# EasyEDA Pro project powermanagmen.eprj

# Schematic powermanagmen
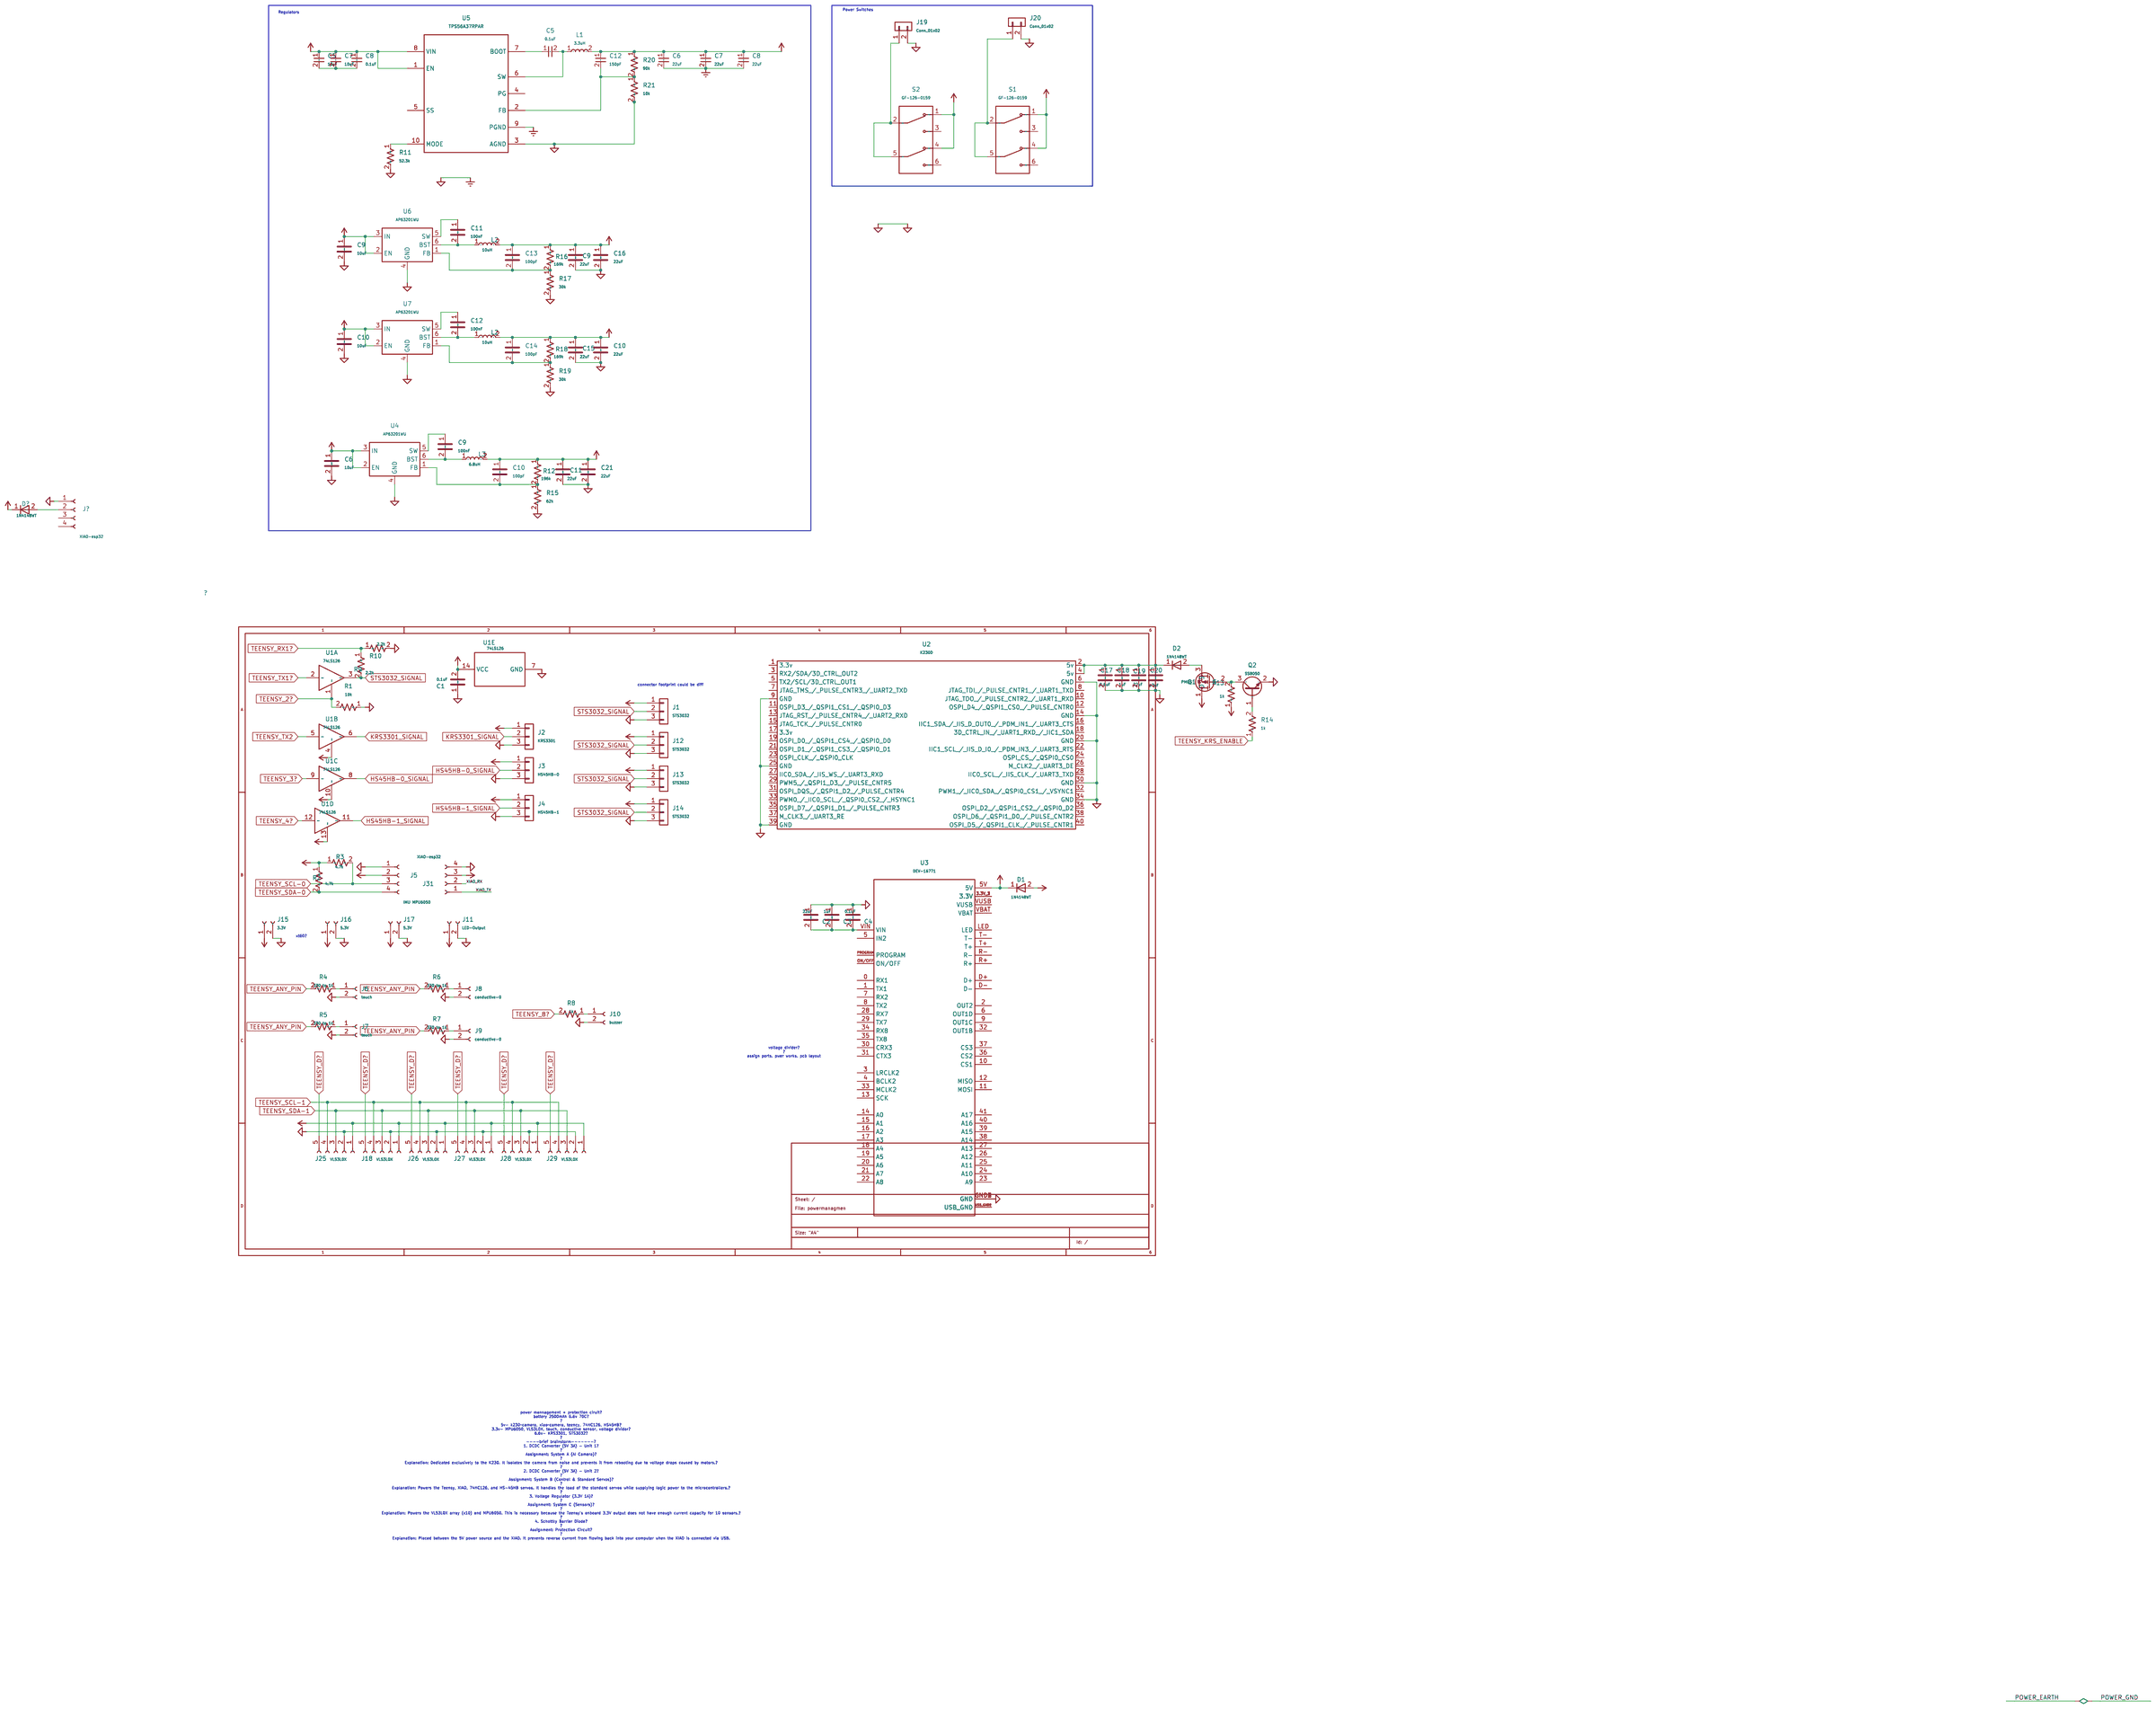
[diagram p0: schematic sheet]

## Parts
C1  0.1uF  [Capacitor_SMD:C_0603_1608Metric_Pad1.08x0.95mm_HandSolder]
C2  22uF
C3  1uF
C4  0.1uF
C5  10uF
C5#2  0.1uF
C6  22uF
C6#2  10uF
C7  22uF
C7#2  10uF
C8  22uF
C8#2  0.1uF
C9  10uF
C9#2  100nF
C9#3  22uF
C10  100pF
C10#2  10uF
C10#3  22uF
C11  100nF
C11#2  22uF
C12  150pF
C12#2  100nF
C13  100pF
C14  100pF
C15  22uF
C16  22uF
C17  0.1uF
C18  1uF
C19  22uF
C20  47uF
C21  22uF
D1  1N4148WT
D2  1N4148WT
D?#2  1N4148WT
J1  STS3032  [Connector_PinHeader_1.00mm:PinHeader_1x03_P1.00mm_Vertical]
J2  KRS3301  [Connector_PinHeader_1.00mm:PinHeader_1x03_P1.00mm_Vertical]
J3  HS45HB-0  [Connector_PinHeader_1.00mm:PinHeader_1x03_P1.00mm_Vertical]
J4  HS45HB-1  [Connector_PinHeader_1.00mm:PinHeader_1x03_P1.00mm_Vertical]
J5  IMU MPU6050  [Connector_JST:JST_XH_B4B-XH-A_1x04_P2.50mm_Vertical]
J6  touch
J7  touch
J8  conductive-0
J9  conductive-0
J10  buzzer
J11  LED-Output
J12  STS3032  [Connector_PinHeader_1.00mm:PinHeader_1x03_P1.00mm_Vertical]
J13  STS3032  [Connector_PinHeader_1.00mm:PinHeader_1x03_P1.00mm_Vertical]
J14  STS3032  [Connector_PinHeader_1.00mm:PinHeader_1x03_P1.00mm_Vertical]
J15  3.3V
J16  5.3V
J17  5.3V
J18  VL53L0X
J19  Conn_01x02
J20  Conn_01x02
J25  VL53L0X
J26  VL53L0X
J27  VL53L0X
J28  VL53L0X
J29  VL53L0X
J31  XIAO-esp32  [Connector_JST:JST_XH_B4B-XH-A_1x04_P2.50mm_Vertical]
J?#1  XIAO-esp32  [Connector_JST:JST_XH_B4B-XH-A_1x04_P2.50mm_Vertical]
L1  3.3uH
L2  10uH
L2#2  10uH
L3  6.8uH
Q1  PMOS
Q2  SS8050
R1  10k  [Resistor_SMD:R_0603_1608Metric_Pad0.98x0.95mm_HandSolder]
R2  4.7k  [Resistor_SMD:R_0603_1608Metric_Pad0.98x0.95mm_HandSolder]
R3  4.7k  [Resistor_SMD:R_0603_1608Metric_Pad0.98x0.95mm_HandSolder]
R4  330 to 1k  [Resistor_SMD:R_0603_1608Metric_Pad0.98x0.95mm_HandSolder]
R5  330 to 1k  [Resistor_SMD:R_0603_1608Metric_Pad0.98x0.95mm_HandSolder]
R6  330 to 1k  [Resistor_SMD:R_0603_1608Metric_Pad0.98x0.95mm_HandSolder]
R7  330 to 1k  [Resistor_SMD:R_0603_1608Metric_Pad0.98x0.95mm_HandSolder]
R8  1k  [Resistor_SMD:R_0603_1608Metric_Pad0.98x0.95mm_HandSolder]
R9  2.2k  [Resistor_SMD:R_0603_1608Metric_Pad0.98x0.95mm_HandSolder]
R10  2.2k  [Resistor_SMD:R_0603_1608Metric_Pad0.98x0.95mm_HandSolder]
R11  52.3k
R12  196k
R13  1k
R14  1k
R15  62k
R16  169k
R17  30k
R18  169k
R19  30k
R20  90k
R21  10k
S1  GF-126-0159
S2  GF-126-0159
U1  74LS126  [Package_SO:SOIC-14_3.9x8.7mm_P1.27mm]  (sections 1,2,3,4,5)
U2  K230D  [Connector_PinSocket_2.54mm:PinSocket_2x20_P2.54mm_Vertical_SMD]
U3  DEV-16771
U4  AP63201WU
U5  TPS56A37RPAR
U6  AP63201WU
U7  AP63201WU

## Library data of the parts
C1-C4 C6#2 C9 C9#2 C9#3 C10 C10#2 C10#3 C11 C11#2 C12#2 C13-C21 = Device_C: Unpolarized capacitor
C5 C5#2 C6 C7 C7#2 C8 C8#2 C12 = Device_C_Small: Unpolarized capacitor, small symbol
D1 D2 D?#2 = Diode_1N4148WT: 75V 0.15A Fast switching Diode, SOD-523; User doc link: https://www.diodes.com/assets/Datasheets/ds30396.pdf; Sim_Device: D; Sim_Pins: 1=K 2=A; Sim.Device: D; Sim.Pins: 1=K 2=A
J1 J3 J4 J12-J14 = Connector_Generic_Conn_01x03: Generic connector, single row, 01x03, script generated (kicad-library-utils/schlib/autogen/connector/); Attribute1: J2
J2 = Connector_Generic_Conn_01x03: Generic connector, single row, 01x03, script generated (kicad-library-utils/schlib/autogen/connector/)
J5 = Connector_Conn_01x04_Socket: Generic connector, single row, 01x04, script generated
J6-J11 J15-J17 = Connector_Conn_01x02_Socket: Generic connector, single row, 01x02, script generated
J18 J25-J29 = Connector_Conn_01x05_Socket: Generic connector, single row, 01x05, script generated
J19 J20 = Connector_Generic_Conn_01x02: Generic connector, single row, 01x02, script generated (kicad-library-utils/schlib/autogen/connector/)
J31 J?#1 = Connector_Conn_01x04_Socket: Generic connector, single row, 01x04, script generated; Attribute1: J5
L1 L2 L2#2 L3 = Device_L: Inductor
Q1 = Simulation_SPICE_PMOS: P-MOSFET transistor, drain/source/gate; User doc link: https://ngspice.sourceforge.io/docs/ngspice-html-manual/manual.xhtml#cha_MOSFETs; Sim_Type: VDMOS; Sim_Pins: 1=D 2=G 3=S; Sim.Type: VDMOS; Sim.Pins: 1=D 2=G 3=S
Q2 = Transistor_BJT_SS8050: General Purpose NPN Transistor, 1.5A Ic, 25V Vce, SOT-23; User doc link: http://www.secosgmbh.com/datasheet/products/SSMPTransistor/SOT-23/SS8050.pdf
R1 R11-R21 = Device_R_US: Resistor, US symbol
R2-R10 = Device_R_US: Resistor, US symbol; Attribute1: R1
S1 S2 = GF-126-0159_GF-126-0159: MF: CW Industries; Purchase-URL: https://pricing.snapeda.com/search/part/GF-126-0159/?ref=eda; Package1: None; Price: None; Availability: In Stock; Description_1: Slide Switch DPDT Through Hole
U1 = 74xx_74LS126: Quad buffer 3-State outputs; Datasheet: http://www.ti.com/lit/gpn/sn74LS126; User doc link: http://www.ti.com/lit/gpn/sn74LS126
U2 = K230D_K230D-Zero: Datasheet: https://docs.banana-pi.org/en/BPI-CanMV-K230D/BananaPi_BPI-CanMV-K230D-Zero; User doc link: https://docs.banana-pi.org/en/BPI-CanMV-K230D/BananaPi_BPI-CanMV-K230D-Zero
U3 = DEV-16771_DEV-16771: MF: SparkFun Electronics; MAXIMUM_PACKAGE_HEIGHT: 4.07mm; Package1: None; Price: None; Check_prices: https://www.snapeda.com/parts/DEV-16771/SparkFun/view-part/?ref=eda; STANDARD: Manufacturer recommendations; PARTREV: 4.1; SnapEDA_Link: https://www.snapeda.com/parts/DEV-16771/SparkFun/view-part/?ref=snap; Description_1: RT1062 Teensy 4.1 series ARM- Cortex--M7 MPU Embedded Evaluation Board; Availability: In Stock; MANUFACTURER: SparkFun Electronics
U4 U6 U7 = Regulator_Switching_AP63201WU: 2A, 500kHz Buck DC/DC Converter, adjustable output voltage, TSOT-23-6; User doc link: https://www.diodes.com/assets/Datasheets/AP63200-AP63201-AP63203-AP63205.pdf
U5 = 2026-01-05_00-17-44_TPS56A37RPAR: User doc link: https://www.ti.com/lit/gpn/tps56a37

## Nets
HS45HB-0_SIGNAL: J3.2(Pin) U1.8
HS45HB-1_SIGNAL: J4.2(Pin) U1.11
KRS3301_SIGNAL: J2.2(Pin) U1.6
POWER_+1V0: C6#2.1 C9.1 C9#3.1 C10.1 C10#2.1 C10#3.1 C11#2.1 C13.1 C14.1 C15.1 C16.1 C21.1 D1.1(K) D1.2(A) D?#2.1(K) J11.1(Pin) J15.1(Pin) J16.1(Pin) J17.1(Pin) J31.3(Pin) L2.2 L2#2.2 L3.2 Q1.1(D) R12.1 R13.1 R16.1 R18.1 S1.1 S1.4 S2.1 S2.4 U3.5V U4.2(EN) U4.3(IN) U6.2(EN) U6.3(IN) U7.2(EN) U7.3(IN)
POWER_+3.3V: J5.2(Pin) J18.1(Pin) J25.1(Pin) J26.1(Pin) J27.1(Pin) J28.1(Pin) J29.1(Pin) R2.1 R3.1
POWER_+5V: C1.2 J3.1(Pin) J4.1(Pin) U1.4 U1.10 U1.13 U1.14(VCC)
POWER_+6V: C5.1 C6.1 C7.1 C7#2.1 C8.1 C8#2.1 C12.1 J1.1(Pin) J2.1(Pin) J12.1(Pin) J13.1(Pin) J14.1(Pin) L1.2 R20.1 U5.1(EN) U5.8(VIN)
POWER_EARTH: C1.1 C2.1 C3.1 C4.1 C6.2 C6#2.2 C7.2 C8.2 C9.2 C9#3.2 C10#2.2 C10#3.2 C11#2.2 C15.2 C16.2 C17.2 C18.2 C19.2 C20.2 C21.2 J1.3(Pin) J2.3(Pin) J3.3(Pin) J4.3(Pin) J5.1(Pin) J6.2(Pin) J7.2(Pin) J8.2(Pin) J9.2(Pin) J10.2(Pin) J11.2(Pin) J12.3(Pin) J13.3(Pin) J14.3(Pin) J15.2(Pin) J16.2(Pin) J17.2(Pin) J18.2(Pin) J19.2(Pin) J20.2(Pin) J25.2(Pin) J26.2(Pin) J27.2(Pin) J28.2(Pin) J29.2(Pin) J31.4(Pin) J?#1.1(Pin) Q2.2(E) R1.1 R10.2 R11.2 R15.2 R17.2 R19.2 R21.2 U1.7(GND) U2.6(GND) U2.9(GND) U2.14(GND) U2.20(GND) U2.25(GND) U2.30(GND) U2.34(GND) U2.39(GND) U3.GND1(GND) U3.GND2(GND) U3.GND3(GND) U3.GND4(GND) U3.GND5(GND) U4.4(GND) U5.3(AGND) U5.9(PGND) U6.4(GND) U7.4(GND)
STS3032_SIGNAL: J1.2(Pin) J12.2(Pin) J13.2(Pin) J14.2(Pin) R9.2 U1.3
TEENSY_2?: R1.2 U1.1
TEENSY_3?: U1.9
TEENSY_4?: U1.12
TEENSY_8?: R8.2
TEENSY_ANY_PIN: R4.2 R5.2 R6.2 R7.2
TEENSY_D?: J18.5(Pin) J25.5(Pin) J26.5(Pin) J27.5(Pin) J28.5(Pin) J29.5(Pin)
TEENSY_KRS_ENABLE: R14.1
TEENSY_RX1?: R9.1 R10.1
TEENSY_SCL-0: J5.3(Pin) R3.2
TEENSY_SCL-1: J18.4(Pin) J25.4(Pin) J26.4(Pin) J27.4(Pin) J28.4(Pin) J29.4(Pin)
TEENSY_SDA-0: J5.4(Pin) R2.2
TEENSY_SDA-1: J18.3(Pin) J25.3(Pin) J26.3(Pin) J27.3(Pin) J28.3(Pin) J29.3(Pin)
TEENSY_TX1?: U1.2
TEENSY_TX2: U1.5
XIAO_RX: J31.2(Pin)
XIAO_TX: J31.1(Pin)
Net-(C2-2): C2.2 C3.2 C4.2 U3.VIN
Net-(C5#2-1): C5#2.1 U5.7(BOOT)
Net-(C5#2-2): C5#2.2 L1.1 U5.6(SW)
Net-(C5-2): C5.2 C7#2.2 C8#2.2
Net-(C9#2-1): C9#2.1 U4.5(SW)
Net-(C9#2-2): C9#2.2 L3.1 U4.6(BST)
Net-(C10-2): C10.2 R12.2 R15.1 U4.1(FB)
Net-(C11-1): C11.1 U6.5(SW)
Net-(C11-2): C11.2 L2.1 U6.6(BST)
Net-(C12#2-1): C12#2.1 U7.5(SW)
Net-(C12#2-2): C12#2.2 L2#2.1 U7.6(BST)
Net-(C12-2): C12.2 R20.2 R21.1 U5.2(FB)
Net-(C13-2): C13.2 R16.2 R17.1 U6.1(FB)
Net-(C14-2): C14.2 R18.2 R19.1 U7.1(FB)
Net-(C17-1): C17.1 C18.1 C19.1 C20.1 D2.1(K) U2.2(5v) U2.4(5v)
Net-(D2-2): D2.2(A) Q1.3(S)
Net-(D?#2-2): D?#2.2(A) J?#1.2(Pin)
Net-(J6-1): J6.1(Pin) R4.1
Net-(J7-1): J7.1(Pin) R5.1
Net-(J8-1): J8.1(Pin) R6.1
Net-(J9-1): J9.1(Pin) R7.1
Net-(J10-1): J10.1(Pin) R8.1
Net-(J19-1): J19.1(Pin) S2.2 S2.5
Net-(J20-1): J20.1(Pin) S1.2 S1.5
Net-(Q1-2): Q1.2(G) Q2.3(C) R13.2
Net-(Q2-1): Q2.1(B) R14.2
Net-(R11-1): R11.1 U5.10(MODE)
Net-(U3-3.3V_1): U3.3.3V_1(3.3V) U3.3.3V_2(3.3V) U3.3.3V_3(3.3V)
Net-(U3-USB_GND1): U3.USB_GND1(USB_GND) U3.USB_GND2(USB_GND)

Not connected (* = marked no-connect by the designer): J?#1 3(Pin) 4(Pin); S1 3 6; S2 3 6; U2 1(3.3v) 3(RX2/SDA/3D_CTRL_OUT2) 5(TX2/SCL/3D_CTRL_OUT1) 7(JTAG_TMS_/_PULSE_CNTR3_/_UART2_TXD) 8(JTAG_TDI_/_PULSE_CNTR1_/_UART1_TXD) 10(JTAG_TDO_/_PULSE_CNTR2_/_UART1_RXD) 11(OSPI_D3_/_QSPI1_CS1_/_QSPI0_D3) 12(OSPI_D4_/_QSPI1_CS0_/_PULSE_CNTR0) 13(JTAG_RST_/_PULSE_CNTR4_/_UART2_RXD) 15(JTAG_TCK_/_PULSE_CNTR0) 16(IIC1_SDA_/_IIS_D_OUT0_/_PDM_IN1_/_UART3_CTS) 17(3.3v) 18(3D_CTRL_IN_/_UART1_RXD_/_IIC1_SDA) 19(OSPI_D0_/_QSPI1_CS4_/_QSPI0_D0) 21(OSPI_D1_/_QSPI1_CS3_/_QSPI0_D1) 22(IIC1_SCL_/_IIS_D_I0_/_PDM_IN3_/_UART3_RTS) 23(OSPI_CLK_/_QSPI0_CLK) 24(OSPI_CS_/_QSPI0_CS0) 26(M_CLK2_/_UART3_DE) 27(IIC0_SDA_/_IIS_WS_/_UART3_RXD) 28(IIC0_SCL_/_IIS_CLK_/_UART3_TXD) 29(PWM5_/_QSPI1_D3_/_PULSE_CNTR5) 31(OSPI_DQS_/_QSPI1_D2_/_PULSE_CNTR4) 32(PWM1_/_IIC0_SDA_/_QSPI0_CS1_/_VSYNC1) 33(PWM0_/_IIC0_SCL_/_QSPI0_CS2_/_HSYNC1) 35(OSPI_D7_/_QSPI1_D1_/_PULSE_CNTR3) 36(OSPI_D2_/_QSPI1_CS2_/_QSPI0_D2) 37(M_CLK3_/_UART3_RE) 38(OSPI_D6_/_QSPI1_D0_/_PULSE_CNTR2) 40(OSPI_D5_/_QSPI1_CLK_/_PULSE_CNTR1); U3 0(RX1) 1(TX1) 2(OUT2) 3(LRCLK2) 4(BCLK2) 5(IN2) 6(OUT1D) 7(RX2) 8(TX2) 9(OUT1C) 10(CS1) 11(MOSI) 12(MISO) 13(SCK) 14(A0) 15(A1) 16(A2) 17(A3) 18(A4) 19(A5) 20(A6) 21(A7) 22(A8) 23(A9) 24(A10) 25(A11) 26(A12) 27(A13) 28(RX7) 29(TX7) 30(CRX3) 31(CTX3) 32(OUT1B) 33(MCLK2) 34(RX8) 35(TX8) 36(CS2) 37(CS3) 38(A14) 39(A15) 40(A16) 41(A17) D+ D- LED ON/OFF PROGRAM R+ R- T+ T- VBAT VUSB; U5 4(PG) 5(SS)

## Notes on the sheet
- Regulators
- Power Switches
- connector footprint could be diff
- xt60?
- voltage divider
  assign ports. pwer works. pcb layout
- power mannagement + protection ciruit
  battery 2500mAh 6.6v 70C
  5v- k230~camera, xiao~camera, teency, 74HC126, HS45HB
  3.3v- MPU6050, VL53L0X, touch, conductive sensor, voltage dividor
  6.6v- KRS3301, STS3032
  ----brief brainstorm-------
  1. DCDC Converter (5V 3A) - Unit 1
  Assignment: System A (AI Camera)
  Explanation: Dedicated exclusively to the K230. It isolates the camera from noise and prevents it from rebooting due to voltage drops caused by motors.
  2. DCDC Converter (5V 3A) - Unit 2
  Assignment: System B (Control & Standard Servos)
  Explanation: Powers the Teensy, XIAO, 74HC126, and HS-45HB servos. It handles the load of the standard servos while supplying logic power to the microcontrollers.
  3. Voltage Regulator (3.3V 1A)
  Assignment: System C (Sensors)
  Explanation: Powers the VL53L0X array (x10) and MPU6050. This is necessary because the Teensy's onboard 3.3V output does not have enough current capacity for 10 sensors.
  4. Schottky Barrier Diode
  Assignment: Protection Circuit
  Explanation: Placed between the 5V power source and the XIAO. It prevents reverse current from flowing back into your computer when the XIAO is connected via USB.

# Board powermanagmen
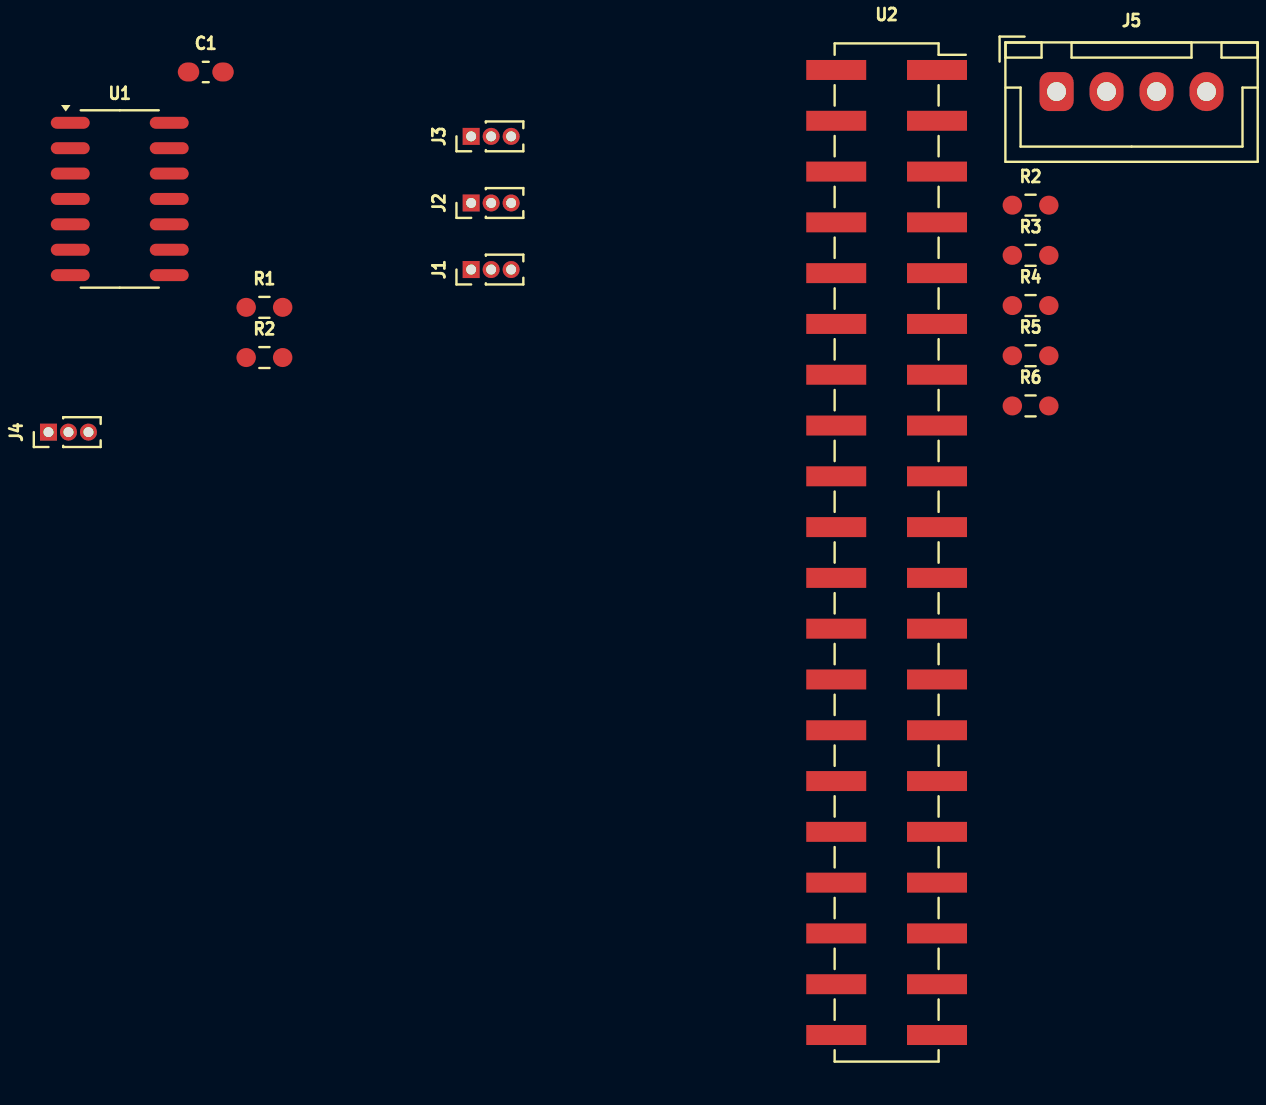
[diagram p1: board, top side]
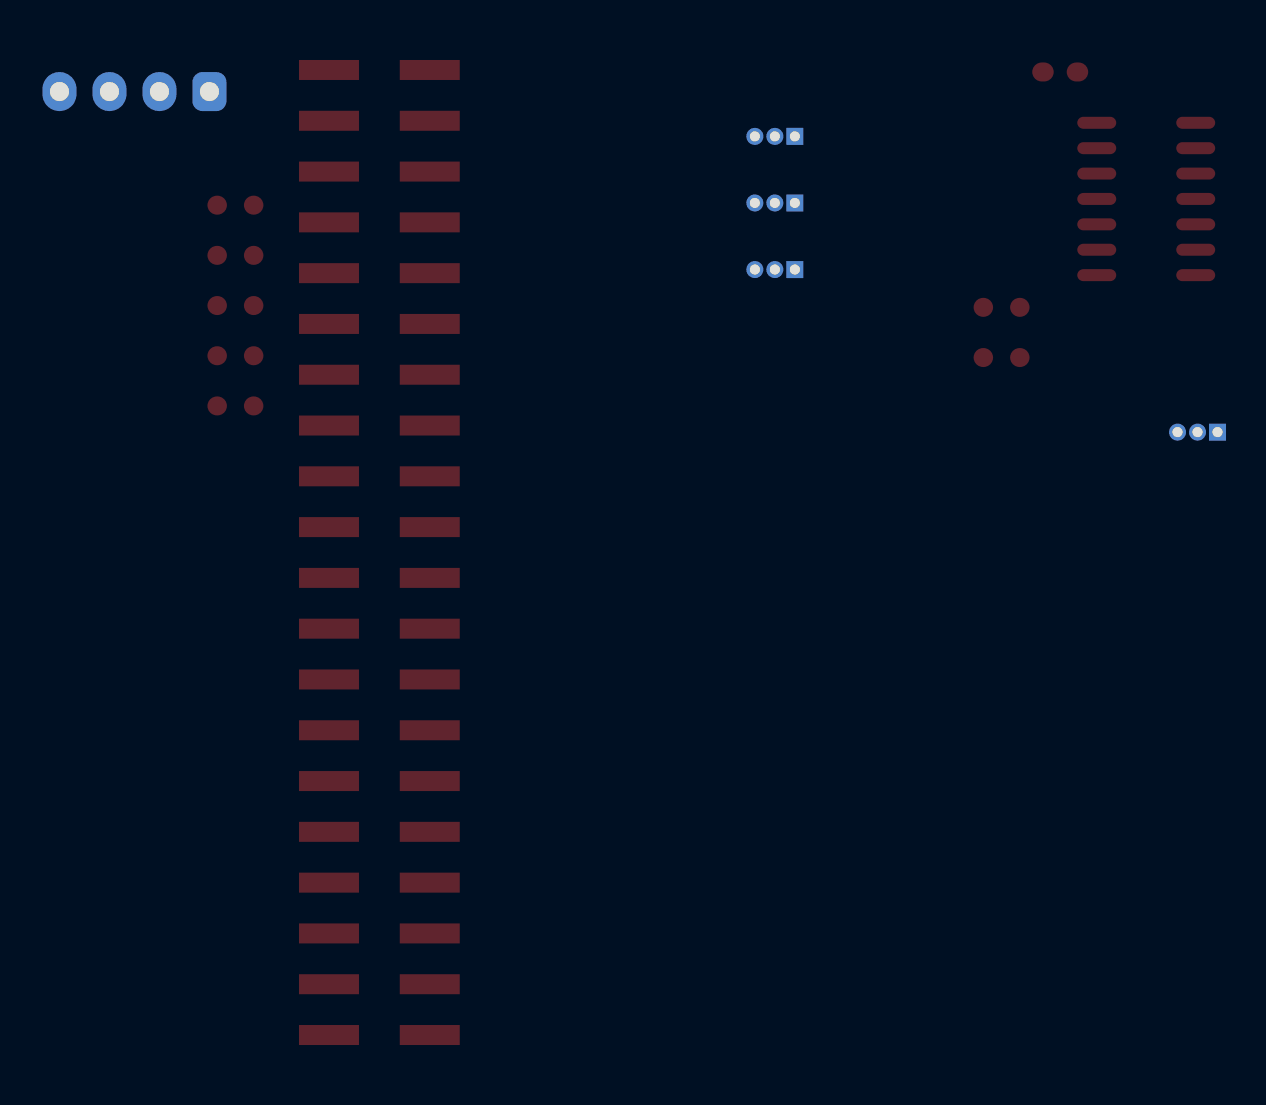
[diagram p2: board, bottom side, seen from below]

No outline. copper layers: Top Layer, Bottom Layer. Coordinates in mm from the lowest, leftmost part position.

## Placement (name value [footprint] x y rotation side)
C1  0.1uF  [Capacitor_SMD:C_0603_1608Metric_Pad1.08x0.95mm_HandSolder]  7.87 24.03 0 top
J1  STS3032  [Connector_PinHeader_1.00mm:PinHeader_1x03_P1.00mm_Vertical]  21.14 14.15 90 top
J2  KRS3301  [Connector_PinHeader_1.00mm:PinHeader_1x03_P1.00mm_Vertical]  21.14 17.48 90 top
J3  HS45HB-0  [Connector_PinHeader_1.00mm:PinHeader_1x03_P1.00mm_Vertical]  21.14 20.81 90 top
J4  HS45HB-1  [Connector_PinHeader_1.00mm:PinHeader_1x03_P1.00mm_Vertical]  0 6.02 90 top
J5  IMU MPU6050  [Connector_JST:JST_XH_B4B-XH-A_1x04_P2.50mm_Vertical]  50.42 23.05 0 top
R1  10k  [Resistor_SMD:R_0603_1608Metric_Pad0.98x0.95mm_HandSolder]  10.8 12.26 0 top
R2  4.7k  [Resistor_SMD:R_0603_1608Metric_Pad0.98x0.95mm_HandSolder]  49.12 17.37 0 top
R2#2  -  [Resistor_SMD:R_0603_1608Metric_Pad0.98x0.95mm_HandSolder]  10.8 9.75 0 top
R3  4.7k  [Resistor_SMD:R_0603_1608Metric_Pad0.98x0.95mm_HandSolder]  49.12 14.86 0 top
R4  330 to 1k  [Resistor_SMD:R_0603_1608Metric_Pad0.98x0.95mm_HandSolder]  49.12 12.35 0 top
R5  330 to 1k  [Resistor_SMD:R_0603_1608Metric_Pad0.98x0.95mm_HandSolder]  49.12 9.84 0 top
R6  330 to 1k  [Resistor_SMD:R_0603_1608Metric_Pad0.98x0.95mm_HandSolder]  49.12 7.33 0 top
U1  74LS126  [Package_SO:SOIC-14_3.9x8.7mm_P1.27mm]  3.56 17.68 0 top
U2  K230D  [Connector_PinSocket_2.54mm:PinSocket_2x20_P2.54mm_Vertical_SMD]  41.92 0 0 top

## Footprints (pads in the part's own frame, mm; a bottom-side part is the same pattern mirrored in y, then rotated)
Capacitor_SMD:C_0603_1608Metric_Pad1.08x0.95mm_HandSolder
  rrect 1.075x0.95 smd: 1(-0.863,0) 2(0.863,0)
Connector_JST:JST_XH_B4B-XH-A_1x04_P2.50mm_Vertical
  rrect 1.7x1.95 hole 0.95: 1(0,0)
  oval 1.7x1.95 hole 0.95: 2(2.5,0) 3(5,0) 4(7.5,0)
Connector_PinHeader_1.00mm:PinHeader_1x03_P1.00mm_Vertical
  rect 0.85x0.85 hole 0.5: 1(0,0)
  round 0.85 hole 0.5: 2(0,-1) 3(0,-2)
Connector_PinSocket_2.54mm:PinSocket_2x20_P2.54mm_Vertical_SMD
  rect 3x1 smd: 1(2.52,24.13) 2(-2.52,24.13) 3(2.52,21.59) 4(-2.52,21.59) 5(2.52,19.05) 6(-2.52,19.05) 7(2.52,16.51) 8(-2.52,16.51) 9(2.52,13.97) 10(-2.52,13.97) 11(2.52,11.43) 12(-2.52,11.43) 13(2.52,8.89) 14(-2.52,8.89) 15(2.52,6.35) 16(-2.52,6.35) 17(2.52,3.81) 18(-2.52,3.81) 19(2.52,1.27) 20(-2.52,1.27) 21(2.52,-1.27) 22(-2.52,-1.27) 23(2.52,-3.81) 24(-2.52,-3.81) 25(2.52,-6.35) 26(-2.52,-6.35) 27(2.52,-8.89) 28(-2.52,-8.89) 29(2.52,-11.43) 30(-2.52,-11.43) 31(2.52,-13.97) 32(-2.52,-13.97) 33(2.52,-16.51) 34(-2.52,-16.51) 35(2.52,-19.05) 36(-2.52,-19.05) 37(2.52,-21.59) 38(-2.52,-21.59) 39(2.52,-24.13) 40(-2.52,-24.13)
Package_SO:SOIC-14_3.9x8.7mm_P1.27mm
  rrect 1.95x0.6 smd: 1(-2.475,3.81) 2(-2.475,2.54) 3(-2.475,1.27) 4(-2.475,0) 5(-2.475,-1.27) 6(-2.475,-2.54) 7(-2.475,-3.81) 8(2.475,-3.81) 9(2.475,-2.54) 10(2.475,-1.27) 11(2.475,0) 12(2.475,1.27) 13(2.475,2.54) 14(2.475,3.81)
Resistor_SMD:R_0603_1608Metric_Pad0.98x0.95mm_HandSolder
  rrect 0.975x0.95 smd: 1(-0.912,0) 2(0.912,0)

## Nets
As in the schematic, except:
+5V: C1.2 J3.1 J4.1 U1.4 U1.10 U1.13 U1.14
+6.6V: J1.1 J2.1
GND: C1.1 J1.3 J2.3 J3.3 J4.3 J5.1 R1.1 U1.7
HS45HB-0 SIGNAL: J3.2 U1.8
HS45HB-1 SIGNAL: J4.2 U1.11
KRS3301 SIGNAL: J2.2 U1.6
STS3032 SIGNAL: J1.2 U1.3
TEENSY 2?: R1.2 U1.1
UNCONNECTED-(R2-PAD1): R2.1 R2#2.1
UNCONNECTED-(R2-PAD2): R2.2 R2#2.2
